# Altium project LM-003.PrjPcb (part 4 of 4)

## Sheet RS232.SchDoc: RS232
size OrCAD A; DocumentNumber: LM-003; Revision: 3.0; SheetNumber: 9; SheetTotal: 11
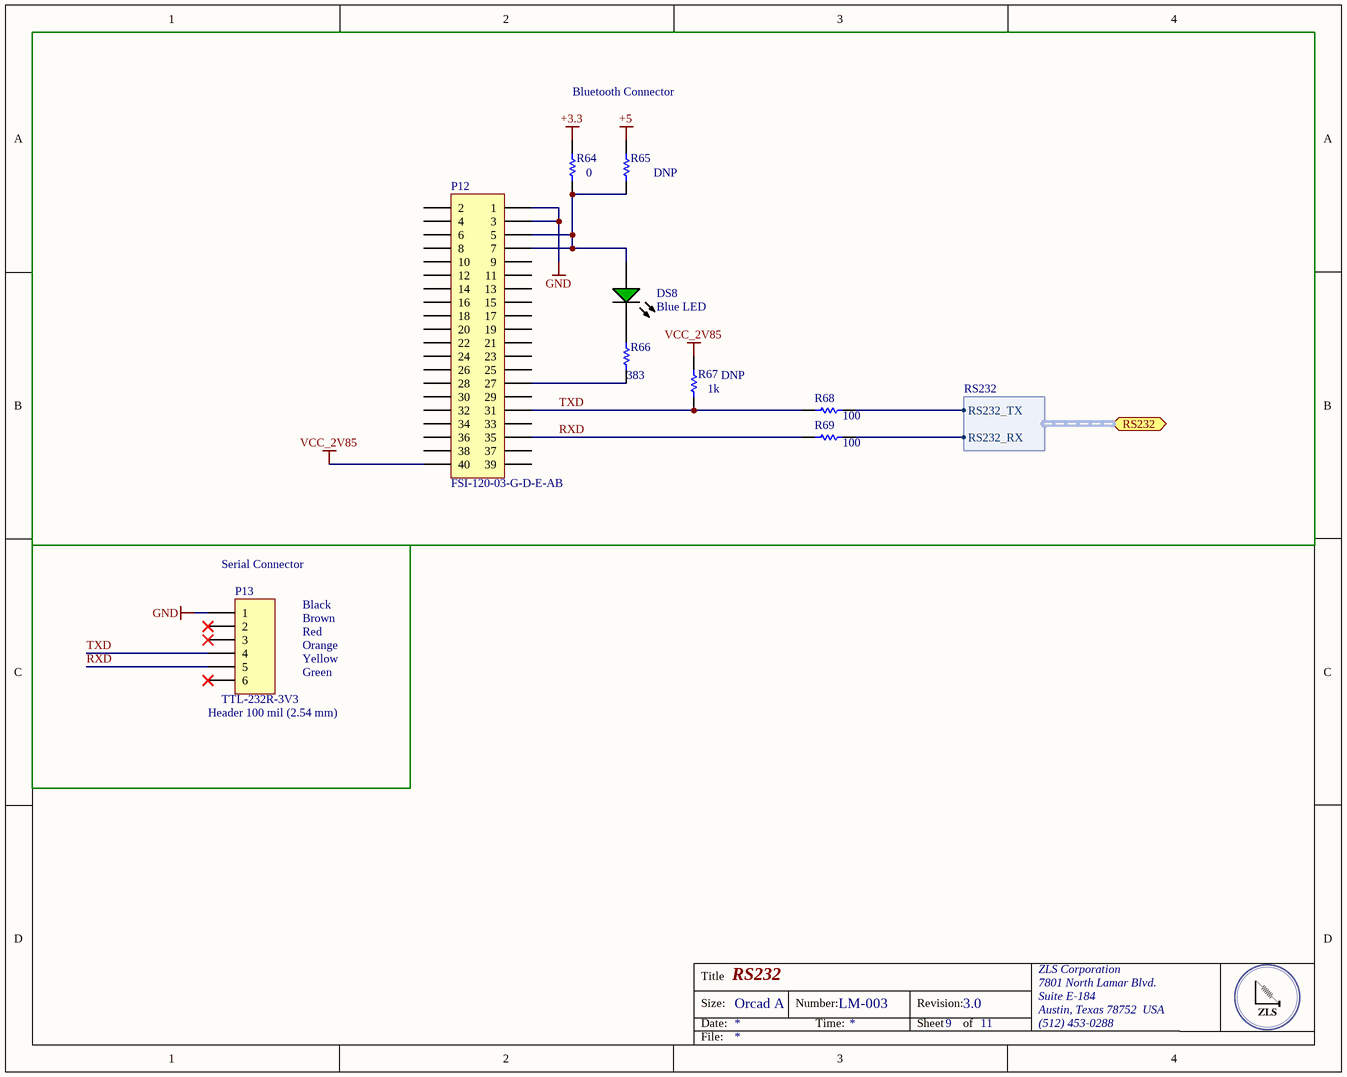
[diagram p8: RS232.SchDoc]

### Parts
DS8  Blue LED  [KING-LED0603-25-GREEN_V]
P12  FSI-120-03-G-D-E-AB  [FSI-120-03-G-D-E-AB]
P13  Header 100 mil (2.54 mm)  [HDR1X6]
R64  Resistance: 0  [RESC0805(2012)_M]  (hidden comment: RES SMD 0.0 OHM JUMPER 1/8W 0805)
R65  DNP  [RESC0805(2012)_M]
R66  Resistance (Ohms): 383  [RESC0805(2012)_M]  (hidden comment: RES SMD 383 OHM 1% 1/8W 0805)
R67  DNP  Resistance (Ohms): 1k  [RESC0805(2012)_M]
R68  Resistance (Ohms): 100  [RESC0805(2012)_L]  (hidden comment: RES SMD 100 OHM 1% 1/8W 0805)
R69  Resistance (Ohms): 100  [RESC0805(2012)_N]  (hidden comment: RES SMD 100 OHM 1% 1/8W 0805)

### Blocks framed on the sheet
Bluetooth Connector: DS8 P12 R64-R69

### Ports
RS232 (harness RS232)

### Harnesses
RS232: RS232_RX, RS232_TX

### Nets
+3.3: R64.2
+5: R65.2
GND: P12.1 P12.3 P13.1
VCC_2V85: P12.40 R67.2
RXD: P12.35 P13.5 R69.2
Serial4_RX: R69.1 ; port RS232.RS232_RX
Serial4_TX: R68.1 ; port RS232.RS232_TX
TXD: P12.31 P13.4 R67.1 R68.2
NetDS8_1: DS8.1(A) P12.5 P12.7 R64.1 R65.1
NetDS8_2: DS8.2(K) R66.2
NetP12_27: P12.27 R66.1

Not connected (* = marked no-connect by the designer): P12 2 4 6 8 9 10 11 12 13 14 15 16 17 18 19 20 21 22 23 24 25 26 28 29 30 32 33 34 36 37 38 39; P13 2* 3* 6*

### Notes on the sheet
- (near P13) Serial Connector
- Black
- Brown
- Red
- Orange
- Yellow
- Green
- (near P13) TTL-232R-3V3
- Title
- Size:
- Date:
- Orcad A
- Number:
- Time:
- Revision:
- Sheet
- of
- ZLS Corporation
- 7801 North Lamar Blvd.
- Suite E-184
- Austin, Texas 78752  USA
- (512) 453-0288
- File:

### Library data of the parts
DS8 = CMP-0239-00001-1: LED 468NM BLUE CLEAR 0603 SMD; Manufacturer 1: Lite-On Inc; Manufacturer Part Number 1: LTST-C191TBKT; Category 1: Optoelectronics; Wavelength - Dominant: 467.5nm; Millicandela Rating: 30mcd; Voltage - Forward (Vf) (Typ): 3.4V; Current - Test: 20mA; Viewing Angle: 130°; Lens Style/Size: Rectangle with Flat Top, 1.1mm x 0.8mm; Supplier 1: Digi-Key; Supplier Part Number 1: 160-1647-1-ND; RoHS 1: RoHS Compliant; Description 1: LED 468NM BLUE CLEAR 0603 SMD; Stock 1: 267074; Pricing 1: 1=0.46, 10=0.342, 100=0.1813, 250=0.12824, 500=0.10944, 1000=0.0855, 2500=0.07524 (USD); Packaging: Cut Tape (CT); Color: Blue; Wavelength - Peak: 468nm; Lens Type: Clear; Package / Case: 0603 (1608 Metric); Size / Dimension: 1.60mm L x 0.80mm W; Height: 0.55mm; Mounting Type: Surface Mount; Luminous Flux @ Current - Test: -; ComponentLink1URL: http://optoelectronics.liteon.com/upload/download/DS22-2000-230/S_110_LTST-C191TBKT.pdf; ComponentLink1Description: http://optoelectronics.liteon.com/upload/download/DS22-2000-230/S_110_LTST-C191TBKT.pdf
P12 = Header 20X2: 1MM SINGLE ELEMENT INTERFACE; Manufacturer 1: Samtec Inc.; Manufacturer Part Number 1: FSI-120-03-G-D-M-AB; Category 1: Connectors, Interconnects; Connector Type: Stacking Compression; Number of Positions: 40; Pitch: 0.039" (1.00mm); Supplier 1: Digi-Key; Supplier Part Number 1: SAM9413-ND; RoHS 1: RoHS Compliant; Description 1: 1MM SINGLE ELEMENT INTERFACE; Stock 1: 144; Pricing 1: 1=8.38, 10=7.752, 25=7.3324, 50=6.9554, 100=6.4945, 250=5.65652, 500=5.447, 1000=5.2375, 2500=5.028 (USD); Packaging: Tube; Part Status: Active; Number of Rows: 2; Mounting Type: Surface Mount; Features: Board Guide, Mounting Flange; Contact Finish: Gold; Contact Finish Thickness: 10µin (0.25µm); Mated Stacking Heights: -; Height Above Board: 0.118" (3.00mm); ComponentLink1URL: http://suddendocs.samtec.com/prints/fsi-1xx-03-x-d-x-xx-xx-mkt.pdf; ComponentLink1Description: http://suddendocs.samtec.com/prints/fsi-1xx-03-x-d-x-xx-xx-mkt.pdf
P13 = Header 6H: CABLE USB SERIAL 3.3V 2MM HEADER; Manufacturer 1: FTDI, Future Technology Devices International Ltd; Manufacturer Part Number 1: TTL-232R-3V3-2MM; Category 1: Cable Assemblies; Usage: USB to TTL Serial 3.3V; Convert From (Adapter End): USB - A, Plug; Convert To (Adapter End): Rectangular Connector, Female Sockets, 8 pos (7 open), 2mm; Shielding: Unshielded; Supplier 1: Digi-Key; Supplier Part Number 1: 768-1095-ND; RoHS 1: RoHS Compliant; Description 1: CABLE USB SERIAL 3.3V 2MM HEADER; Stock 1: 274; Pricing 1: 1=20, 10=18, 50=16.875 (USD); Part Status: Active; Length: 5.90' (1.80m); ComponentLink1URL: http://www.ftdichip.com/Support/Documents/DataSheets/Cables/DS_TTL-232R_CABLES.pdf; ComponentLink1Description: http://www.ftdichip.com/Support/Documents/DataSheets/Cables/DS_TTL-232R_CABLES.pdf
R64 = CMP-1013-00017-1: Manufacturer: Vishay; Manufacturer Part Number: CRCW08050000Z0EA; Power Rating: 125mW; Voltage Rating: 150V; Tolerance: 1%; Temperature Coefficient: 100ppm/°C; Supplier 1: Digi-Key; Supplier Part Number 1: 541-0.0ADKR-ND; Stock 1: 415251; Pricing 1: 1=0.1, 10=0.026, 25=0.0184, 50=0.014, 100=0.0104, 250=0.0079, 500=0.0063, 1000=0.0047 (USD); Case/Package: 0805; Weight: 0.000194oz; Contact Plating: Tin,Lead; Case Code (Imperial): 0805; Case Code (Metric): 2012; Min Operating Temperature: -55°C; Max Operating Temperature: 155°C; Composition: Thick Film; Termination: SMD/SMT; Packaging: Tape and Reel; Package Quantity: 1; Number of Terminations: 2; Military Standard: Not; Max Power Dissipation: 125mW; Voltage Rating (DC): 150V; Length: 2mm; Height: 0.45mm; Width: 1.25mm; Depth: 1.25mm; Radiation Hardening: No; Lead Free: Lead Free; REACH SVHC: Unknown; ComponentLink1URL: https://datasheet.ciiva.com/16883/dcrcwe3-16883622.pdf; ComponentLink1Description: https://datasheet.ciiva.com/16883/dcrcwe3-16883622.pdf; ComponentLink2URL: https://datasheet.ciiva.com/26314/fld-crcw-e3-data-en-26314630.pdf; ComponentLink2Description: https://datasheet.ciiva.com/26314/fld-crcw-e3-data-en-26314630.pdf; ComponentLink3URL: https://datasheet.ciiva.com/5543/dcrcwe3-109170-5543096.pdf; ComponentLink3Description: https://datasheet.ciiva.com/5543/dcrcwe3-109170-5543096.pdf; ComponentLink4URL: https://datasheet.ciiva.com/11811/0900766b80d98b26-11811304.pdf; ComponentLink4Description: https://datasheet.ciiva.com/11811/0900766b80d98b26-11811304.pdf; ComponentLink5URL: https://datasheet.ciiva.com/16389/dcrcwe3-16389338.pdf; ComponentLink5Description: https://datasheet.ciiva.com/16389/dcrcwe3-16389338.pdf; ComponentLink6URL: https://datasheet.ciiva.com/16719/70201119-16719706.pdf; ComponentLink6Description: https://datasheet.ciiva.com/16719/70201119-16719706.pdf; ComponentLink7URL: https://datasheet.ciiva.com/2463/dcrcwe3-2463037.pdf; ComponentLink7Description: https://datasheet.ciiva.com/2463/dcrcwe3-2463037.pdf; ComponentLink8URL: https://datasheet.ciiva.com/7841/1697337-7841629.pdf; ComponentLink8Description: https://datasheet.ciiva.com/7841/1697337-7841629.pdf; ComponentLink9URL: https://datasheet.ciiva.com/2463/dcrcwe3-2463038.pdf; ComponentLink9Description: https://datasheet.ciiva.com/2463/dcrcwe3-2463038.pdf; ComponentLink10URL: https://datasheet.ciiva.com/2463/dcrcwe3-2463039.pdf; ComponentLink10Description: https://datasheet.ciiva.com/2463/dcrcwe3-2463039.pdf; ComponentLink11URL: https://datasheet.ciiva.com/7841/1720486-7841839.pdf; ComponentLink11Description: https://datasheet.ciiva.com/7841/1720486-7841839.pdf
R65 = CMP-1013-00017-1: RES SMD 0.0 OHM JUMPER 1/8W 0805; Manufacturer: Vishay; Manufacturer Part Number: CRCW08050000Z0EA; Resistance: 0; Power Rating: 125mW; Voltage Rating: 150V; Tolerance: 1%; Temperature Coefficient: 100ppm/°C; Supplier 1: Digi-Key; Supplier Part Number 1: 541-0.0ADKR-ND; Stock 1: 415251; Pricing 1: 1=0.1, 10=0.026, 25=0.0184, 50=0.014, 100=0.0104, 250=0.0079, 500=0.0063, 1000=0.0047 (USD); Case/Package: 0805; Weight: 0.000194oz; Contact Plating: Tin,Lead; Case Code (Imperial): 0805; Case Code (Metric): 2012; Min Operating Temperature: -55°C; Max Operating Temperature: 155°C; Composition: Thick Film; Termination: SMD/SMT; Packaging: Tape and Reel; Package Quantity: 1; Number of Terminations: 2; Military Standard: Not; Max Power Dissipation: 125mW; Voltage Rating (DC): 150V; Length: 2mm; Height: 0.45mm; Width: 1.25mm; Depth: 1.25mm; Radiation Hardening: No; Lead Free: Lead Free; REACH SVHC: Unknown; ComponentLink1URL: https://datasheet.ciiva.com/16883/dcrcwe3-16883622.pdf; ComponentLink1Description: https://datasheet.ciiva.com/16883/dcrcwe3-16883622.pdf; ComponentLink2URL: https://datasheet.ciiva.com/26314/fld-crcw-e3-data-en-26314630.pdf; ComponentLink2Description: https://datasheet.ciiva.com/26314/fld-crcw-e3-data-en-26314630.pdf; ComponentLink3URL: https://datasheet.ciiva.com/5543/dcrcwe3-109170-5543096.pdf; ComponentLink3Description: https://datasheet.ciiva.com/5543/dcrcwe3-109170-5543096.pdf; ComponentLink4URL: https://datasheet.ciiva.com/11811/0900766b80d98b26-11811304.pdf; ComponentLink4Description: https://datasheet.ciiva.com/11811/0900766b80d98b26-11811304.pdf; ComponentLink5URL: https://datasheet.ciiva.com/16389/dcrcwe3-16389338.pdf; ComponentLink5Description: https://datasheet.ciiva.com/16389/dcrcwe3-16389338.pdf; ComponentLink6URL: https://datasheet.ciiva.com/16719/70201119-16719706.pdf; ComponentLink6Description: https://datasheet.ciiva.com/16719/70201119-16719706.pdf; ComponentLink7URL: https://datasheet.ciiva.com/2463/dcrcwe3-2463037.pdf; ComponentLink7Description: https://datasheet.ciiva.com/2463/dcrcwe3-2463037.pdf; ComponentLink8URL: https://datasheet.ciiva.com/7841/1697337-7841629.pdf; ComponentLink8Description: https://datasheet.ciiva.com/7841/1697337-7841629.pdf; ComponentLink9URL: https://datasheet.ciiva.com/2463/dcrcwe3-2463038.pdf; ComponentLink9Description: https://datasheet.ciiva.com/2463/dcrcwe3-2463038.pdf; ComponentLink10URL: https://datasheet.ciiva.com/2463/dcrcwe3-2463039.pdf; ComponentLink10Description: https://datasheet.ciiva.com/2463/dcrcwe3-2463039.pdf; ComponentLink11URL: https://datasheet.ciiva.com/7841/1720486-7841839.pdf; ComponentLink11Description: https://datasheet.ciiva.com/7841/1720486-7841839.pdf
R66 = CMP-1013-00017-1: Manufacturer: Vishay Dale; Manufacturer Part Number: CRCW0805383RFKEA; Power (Watts): 0.125W, 1/8W; Temperature Coefficient: ±100ppm/°C; Supplier 1: Digi-Key; Supplier Part Number 1: 541-383CDKR-ND; RoHS: RoHS Compliant; Category: Resistors; Stock 1: 21887; Pricing 1: 1=0.1, 10=0.044, 100=0.0178, 1000=0.00802, 2500=0.00696 (USD); Packaging: Digi-Reel®; Part Status: Active; Tolerance: ±1%; Composition: Thick Film; Features: Automotive AEC-Q200; Operating Temperature: -55°C ~ 155°C; Package / Case: 0805 (2012 Metric); Supplier Device Package: 0805; Size / Dimension: 0.079" L x 0.049" W (2.00mm x 1.25mm); Height - Seated (Max): 0.020" (0.50mm); Failure Rate: -; ComponentLink1URL: http://www.vishay.com/docs/20035/dcrcwe3.pdf; ComponentLink1Description: http://www.vishay.com/docs/20035/dcrcwe3.pdf
R67 = CMP-1013-00017-1: RES SMD 1K OHM 1% 1/2W 0805; Manufacturer: Vishay Dale; Manufacturer Part Number: CRCW08051K00FKEAHP; Power (Watts): 0.5W, 1/2W; Temperature Coefficient: ±100ppm/°C; Supplier 1: Digi-Key; Supplier Part Number 1: 541-1.00KTDKR-ND; RoHS: RoHS Compliant; Category: Resistors; Stock 1: 64012; Pricing 1: 1=0.28, 10=0.233, 100=0.0911, 1000=0.03812, 2500=0.03494 (USD); Packaging: Digi-Reel®; Part Status: Active; Tolerance: ±1%; Composition: Thick Film; Features: Automotive AEC-Q200, Pulse Withstanding; Operating Temperature: -55°C ~ 155°C; Package / Case: 0805 (2012 Metric); Supplier Device Package: 0805; Size / Dimension: 0.079" L x 0.049" W (2.00mm x 1.25mm); Height - Seated (Max): 0.020" (0.50mm); Failure Rate: -; ComponentLink1URL: http://www.vishay.com/docs/20043/crcwhpe3.pdf; ComponentLink1Description: http://www.vishay.com/docs/20043/crcwhpe3.pdf
R68 R69 = CMP-1013-00393-1: Manufacturer: Vishay Dale; Manufacturer Part Number: CRCW0805100RFKEA; Power (Watts): 0.125W, 1/8W; Temperature Coefficient: ±100ppm/°C; Supplier 1: Digi-Key; Supplier Part Number 1: 541-100CDKR-ND; RoHS: RoHS Compliant; Category: Resistors; Stock 1: 281212; Pricing 1: 1=0.1, 10=0.044, 100=0.0178, 1000=0.00802, 2500=0.00696 (USD); Packaging: Digi-Reel®; Part Status: Active; Tolerance: ±1%; Composition: Thick Film; Features: Automotive AEC-Q200; Operating Temperature: -55°C ~ 155°C; Package / Case: 0805 (2012 Metric); Supplier Device Package: 0805; Size / Dimension: 0.079" L x 0.049" W (2.00mm x 1.25mm); Height - Seated (Max): 0.020" (0.50mm); Failure Rate: -; ComponentLink1URL: http://www.vishay.com/docs/20035/dcrcwe3.pdf; ComponentLink1Description: http://www.vishay.com/docs/20035/dcrcwe3.pdf

## Nets that join several sheets
+3.3: Power (R5.2), ADC (C38.1 C39.1 U15.17 U15.18), BBB Headers (U16.9-3 U16.9-4), Power Monitor (5 pins), Real Time Clock (C46.1 C47.1 U19.2), RS232 (R64.2)
+5: Power (9 pins), FeedbackLoop (10 pins), ADC (8 pins), BBB Headers (R35.2 R36.2), Connectors (P3.7 P4.1 P5.1 R37.2), heater_control (6 pins), Power Monitor (C48.2 R60.2 U20.5), RS232 (R65.2)
+5 BBB: Power (6 pins), BBB Headers (U16.9-5 U16.9-6)
+9: Power (C2.2 U2.1 U2.2), FeedbackLoop (C28.2 U10.16)
+12: Power (C5.2 C19.2 U2.8 U6.4), heater_control (10 pins), Power Monitor (R61.2)
-5: Power (C13.1 U3.6), FeedbackLoop (C23.2 C29.1 U8#1.4 U10.5), ADC (U13.10 U13.11), Connectors (P3.5), Power Monitor (U20.2)
AGND: Power (R8.2), FeedbackLoop (13 pins), ADC (11 pins), Connectors (P6.2), heater_control (6 pins), Power Monitor (10 pins)
Batt+: Power (P1.1 RL1.5), Power Monitor (R56.2)
GND: Power (33 pins), FeedbackLoop (13 pins), ADC (C38.2 C39.2 U15.15 U15.16), BBB Headers (8 pins), Connectors (5 pins), heater_control (5 pins), Real Time Clock (BT1.2 C46.2 C47.2 U19.5), RS232 (P12.1 P12.3 P13.1)
ZH: Power (5 pins), FeedbackLoop (C27.1 TP3.1 U9.8), Connectors (P3.10), Power Monitor (R54.2)
ZP: FeedbackLoop (C26.1 TP2.1 U9.1), ADC (R32.2), Connectors (P3.6)
BEAM: FeedbackLoop (U10.4), Connectors (P3.3)
I2C2_SCL: BBB Headers (R36.1 U16.9-19), Connectors (P5.3), Real Time Clock (U19.8)
I2C2_SDA: BBB Headers (R35.1 U16.9-20), Connectors (P5.2), Real Time Clock (U19.7)
IC_Thermistor: BBB Headers (U16.9-36), Power Monitor (U20.1 U20.4)
Lid Thermistor: Connectors (P6.1 R37.1), Power Monitor (R57.2)
NetC24_1: FeedbackLoop (C24.1 R11.1 R13.1), ADC (U13.3)
NetP2_2: Power (P2.2), BBB Headers (U16.9-9)
NetP3_2: FeedbackLoop (U11.1 U11.2), Connectors (P3.2)
NetP3_4: FeedbackLoop (U11.6), Connectors (P3.4)
NetP3_12: FeedbackLoop (U7#2.2 U7#2.6), Connectors (P3.12)
NetP7_2: ADC (U14.10), heater_control (P7.2 R40.1)
NetP7_4: ADC (U14.12), heater_control (P7.4 R39.2)
NetP8_4: ADC (U13.12), heater_control (P8.4 R41.1)
NetP9_4: ADC (U14.5), heater_control (P9.4 R45.2)
NetP10_4: ADC (U14.3), heater_control (P10.4 R48.1)
NetP11_4: heater_control (P11.4 R52.2), Power Monitor (U20.3)
NetR17_1: FeedbackLoop (R17.1), BBB Headers (U16.8-19)
NetR43_1: BBB Headers (U16.8-3), heater_control (R43.1)
NetR44_1: BBB Headers (U16.8-6), heater_control (R44.1)
NetR47_1: BBB Headers (U16.8-5), heater_control (R47.1)
NetR50_1: BBB Headers (U16.8-4), heater_control (R50.1)
NetR53_1: BBB Headers (U16.8-14), heater_control (R53.1)
NetU2_5: Power (U2.5), BBB Headers (U16.8-10)
NetU5_1: Power (U5.1), BBB Headers (U16.8-22)
NetU7#2_3: FeedbackLoop (U7#2.3), BBB Headers (U16.9-14)
NetU16_9-33: BBB Headers (U16.9-33), Power Monitor (U18.1 U18.2)
NetU16_9-35: BBB Headers (U16.9-35), Power Monitor (U18.6 U18.7)
NetU16_9-37: BBB Headers (U16.9-37), Power Monitor (U17.8 U17.9)
NetU16_9-39: BBB Headers (U16.9-39), Power Monitor (U17.1 U17.2)
NetU16_9-40: BBB Headers (U16.9-40), Power Monitor (U17.6 U17.7)
PWM2: FeedbackLoop (R16.1 U10.20), BBB Headers (U16.8-13)
Serial4_RX: BBB Headers (U16.9-11), RS232 (R69.1)
Serial4_TX: BBB Headers (U16.9-13), RS232 (R68.1)
SPI0_CS0: ADC (U15.10), BBB Headers (U16.9-17)
SPI0_MISO: ADC (U15.14), BBB Headers (U16.9-21)
SPI0_MOSI: ADC (U15.11), BBB Headers (U16.9-18)
SPI0_SCLK: ADC (U15.13), BBB Headers (U16.9-22)
SPI1_CS0: BBB Headers (U16.9-28), Connectors (P4.7)
SPI1_MISO: BBB Headers (U16.9-29), Connectors (P4.4)
SPI1_MOSI: BBB Headers (U16.9-30), Connectors (P4.5)
SPI1_SCLK: BBB Headers (U16.9-31), Connectors (P4.6)